# Altium schematic sheet Connectors.SchDoc
size A; SheetNumber: 4; SheetTotal: 13
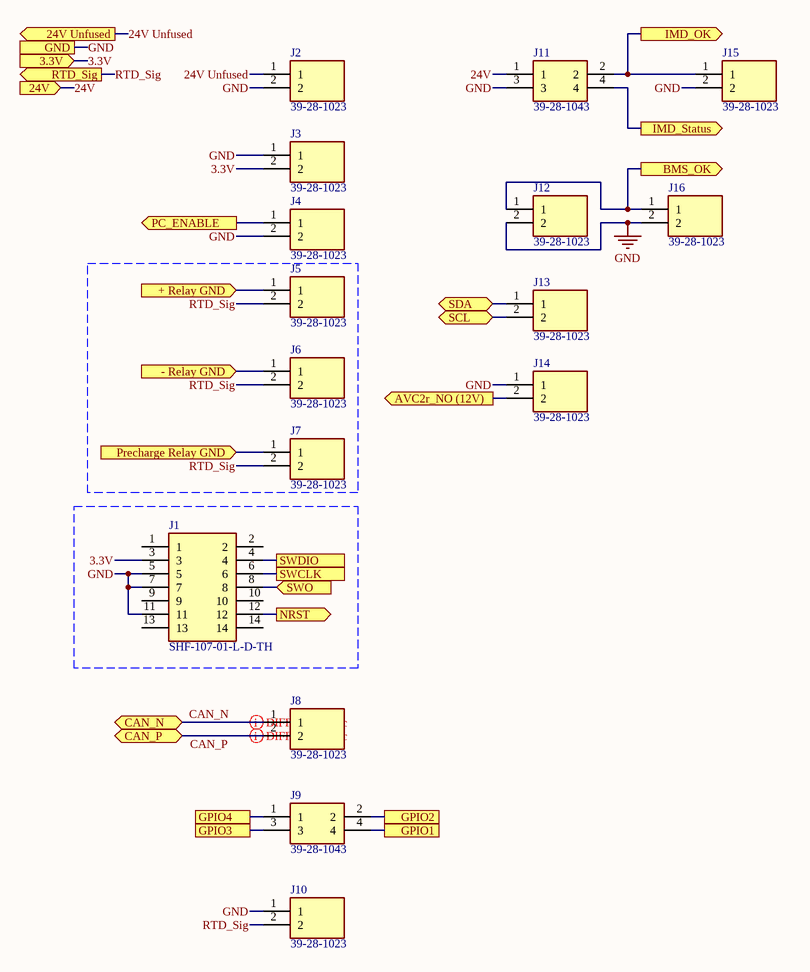
[diagram p0: Connectors.SchDoc]

## Parts
J1  SHF-107-01-L-D-TH  [SHF10701LDTH]
J2  39-28-1023  [39-28-1023]
J3  39-28-1023  [39-28-1023]
J4  39-28-1023  [39-28-1023]
J5  39-28-1023  [39-28-1023]
J6  39-28-1023  [39-28-1023]
J7  39-28-1023  [39-28-1023]
J8  39-28-1023  [39-28-1023]
J9  39-28-1043  [39-28-1043]
J10  39-28-1023  [39-28-1023]
J11  39-28-1043  [39-28-1043]
J12  39-28-1023  [39-28-1023]
J13  39-28-1023  [39-28-1023]
J14  39-28-1023  [39-28-1023]
J15  39-28-1023  [39-28-1023]
J16  39-28-1023  [39-28-1023]

## Ports
3.3V (in), 24V (in), 24V Unfused (out), + Relay GND (in), - Relay GND (in), AVC2r_NO (12V) (out), BMS_OK (out), CAN_N (bidir), CAN_P (bidir), GND, GPIO1, GPIO2, GPIO3, GPIO4, IMD_OK (out), IMD_Status (out), NRST (out), PC_ENABLE (out), Precharge Relay GND (in), RTD_Sig (out), SCL (bidir), SDA (bidir), SWCLK, SWDIO, SWO (in)

## Nets
GND: J1.5 J1.7 J1.11 J2.2 J3.1 J4.2 J10.1 J11.3 J12.2 J14.1 J15.2 J16.2 ; port GND
3.3V: J1.3 J3.2 ; port 3.3V
24V: J11.1 ; port 24V
24V Unfused: J2.1 ; port 24V Unfused
+ Relay GND: J5.1 ; port + Relay GND
- Relay GND: J6.1 ; port - Relay GND
AVC2r_NO (12V): J14.2 ; port AVC2r_NO (12V)
BMS_OK: J12.1 J16.1 ; port BMS_OK
CAN_N: J8.1 ; port CAN_N
CAN_P: J8.2 ; port CAN_P
GPIO1: J9.4 ; port GPIO1
GPIO2: J9.2 ; port GPIO2
GPIO3: J9.3 ; port GPIO3
GPIO4: J9.1 ; port GPIO4
IMD_OK: J11.2 J15.1 ; port IMD_OK
IMD_Status: J11.4 ; port IMD_Status
NRST: J1.12 ; port NRST
PC_ENABLE: J4.1 ; port PC_ENABLE
Precharge Relay GND: J7.1 ; port Precharge Relay GND
RTD_Sig: J5.2 J6.2 J7.2 J10.2 ; port RTD_Sig
SCL: J13.2 ; port SCL
SDA: J13.1 ; port SDA
SWCLK: J1.6 ; port SWCLK
SWDIO: J1.4 ; port SWDIO
SWO: J1.8 ; port SWO

Not connected (* = marked no-connect by the designer): J1 1 2 9 10 13 14

## Layout directives
differential pair; differential pair class diffc: CAN_N, CAN_P

## Library data of the parts
J1 = SHF-107-01-L-D-TH: Connector; Manufacturer_Name: SAMTEC; Datasheet Link: https://componentsearchengine.com/Datasheets/1/SHF-107-01-L-D-TH.pdf; Height: 5.33mm; Manufacturer_Part_Number: SHF-107-01-L-D-TH; Mouser Part Number: 200-SHF10701LDTH; Mouser Price/Stock: https://www.mouser.co.uk/ProductDetail/Samtec/SHF-107-01-L-D-TH?qs=%252BZP6%2F%252BtExtDrbekpOnhfag%3D%3D; Arrow Part Number: SHF-107-01-L-D-TH; Arrow Price/Stock: https://www.arrow.com/en/products/shf-107-01-l-d-th/samtec?utm_currency=USD&region=nac
J2-J8 J10 J12-J16 = 39-28-1023: Connector; Manufacturer_Name: Molex; Datasheet Link: https://www.molex.com/pdm_docs/sd/039281023_sd.pdf; Height: 12.8mm; Manufacturer_Part_Number: 39-28-1023; Mouser Part Number: 538-39-28-1023; Mouser Price/Stock: https://www.mouser.co.uk/ProductDetail/Molex/39-28-1023?qs=LQQHZ4xw2XBykFU0jRHvlQ%3D%3D; Arrow Part Number: 39-28-1023; Arrow Price/Stock: https://www.arrow.com/en/products/39-28-1023/molex?region=nac
J9 J11 = 39-28-1043: Connector; Manufacturer_Name: Molex; Datasheet Link: https://www.molex.com/pdm_docs/sd/039281023_sd.pdf; Height: 12.8mm; Manufacturer_Part_Number: 39-28-1043; Mouser Part Number: 538-39-28-1043; Mouser Price/Stock: https://www.mouser.co.uk/ProductDetail/Molex/39-28-1043?qs=LQQHZ4xw2XCMHoV0KRLGhg%3D%3D; Arrow Part Number: 39-28-1043; Arrow Price/Stock: https://www.arrow.com/en/products/39-28-1043/molex?region=nac